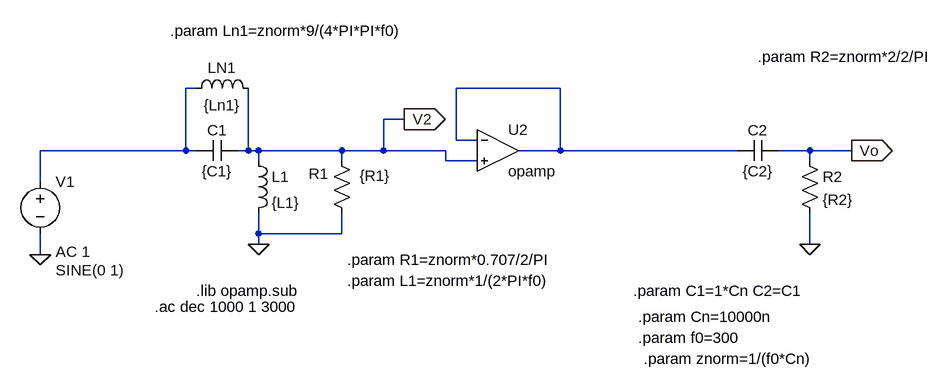
[diagram p0: schematic TS6_2.asc]
TS6_2.asc, the LTspice schematic file:
Version 4
SHEET 1 1364 680
WIRE -320 -96 -336 -96
WIRE 240 -96 80 -96
WIRE 0 -48 -32 -48
WIRE 80 -16 80 -96
WIRE 112 -16 80 -16
WIRE -336 0 -336 -96
WIRE -336 0 -560 0
WIRE -320 0 -336 0
WIRE -240 0 -240 -96
WIRE -240 0 -256 0
WIRE -224 0 -240 0
WIRE -96 0 -224 0
WIRE -32 0 -32 -48
WIRE -32 0 -96 0
WIRE 64 0 -32 0
WIRE 240 0 240 -96
WIRE 240 0 176 0
WIRE 512 0 240 0
WIRE 624 0 576 0
WIRE 688 0 624 0
WIRE -224 16 -224 0
WIRE -96 16 -96 0
WIRE 64 16 64 0
WIRE 112 16 64 16
WIRE 624 16 624 0
WIRE -560 48 -560 0
WIRE -224 128 -224 96
WIRE -96 128 -96 96
WIRE -96 128 -224 128
WIRE -224 144 -224 128
WIRE 624 144 624 96
WIRE -560 160 -560 128
FLAG -560 160 0
FLAG -224 144 0
FLAG 688 0 Vo
IOPIN 688 0 Out
FLAG 624 144 0
FLAG 0 -48 V2
IOPIN 0 -48 Out
SYMBOL voltage -560 32 R0
WINDOW 123 24 124 Left 2
WINDOW 39 0 0 Left 0
WINDOW 3 24 152 Left 2
SYMATTR Value2 AC 1
SYMATTR Value SINE(0 1)
SYMATTR InstName V1
SYMBOL res -80 112 R180
WINDOW 0 36 76 Left 2
WINDOW 3 -59 73 Left 2
SYMATTR InstName R1
SYMATTR Value {R1}
SYMBOL ind -240 0 R0
SYMATTR InstName L1
SYMATTR Value {L1}
SYMBOL cap -256 -16 R90
WINDOW 0 0 32 VBottom 2
WINDOW 3 32 32 VTop 2
SYMATTR InstName C1
SYMATTR Value {C1}
SYMBOL OpAmps\\opamp 144 -64 R0
SYMATTR InstName U2
SYMBOL ind -336 -80 R270
WINDOW 0 32 56 VTop 2
WINDOW 3 5 56 VBottom 2
SYMATTR InstName LN1
SYMATTR Value {Ln1}
SYMBOL res 608 0 R0
SYMATTR InstName R2
SYMATTR Value {R2}
SYMBOL cap 576 -16 R90
WINDOW 0 0 32 VBottom 2
WINDOW 3 32 32 VTop 2
SYMATTR InstName C2
SYMATTR Value {C2}
TEXT -320 216 Left 2 !.lib opamp.sub
TEXT -384 240 Left 2 !.ac dec 1000 1 3000
TEXT 352 216 Left 2 !.param C1=1*Cn C2=C1
TEXT 360 256 Left 2 !.param Cn=10000n
TEXT 360 288 Left 2 !.param f0=300
TEXT 368 320 Left 2 !.param znorm=1/(f0*Cn)
TEXT -360 -184 Left 2 !.param Ln1=znorm*9/(4*PI*PI*f0)
TEXT -88 168 Left 2 !.param R1=znorm*0.707/2/PI
TEXT -88 200 Left 2 !.param L1=znorm*1/(2*PI*f0)
TEXT 544 -144 Left 2 !.param R2=znorm*2/2/PI

The netlist it stands for:
* TS6_2.asc
V1 N001 0 SINE(0 1) AC 1
R1 0 V2 {R1}
L1 V2 0 {L1}
C1 V2 N001 {C1}
XU2 N002 V2 N002 opamp Aol=100K GBW=10Meg  ; pins invin noninvin out
LN1 N001 V2 {Ln1}
R2 Vo 0 {R2}
C2 Vo N002 {C2}
.lib opamp.sub
.ac dec 1000 1 3000
.param C1=1*Cn C2=C1
.param Cn=10000n
.param f0=300
.param znorm=1/(f0*Cn)
.param Ln1=znorm*9/(4*PI*PI*f0)
.param R1=znorm*0.707/2/PI
.param L1=znorm*1/(2*PI*f0)
.param R2=znorm*2/2/PI
.backanno
.end